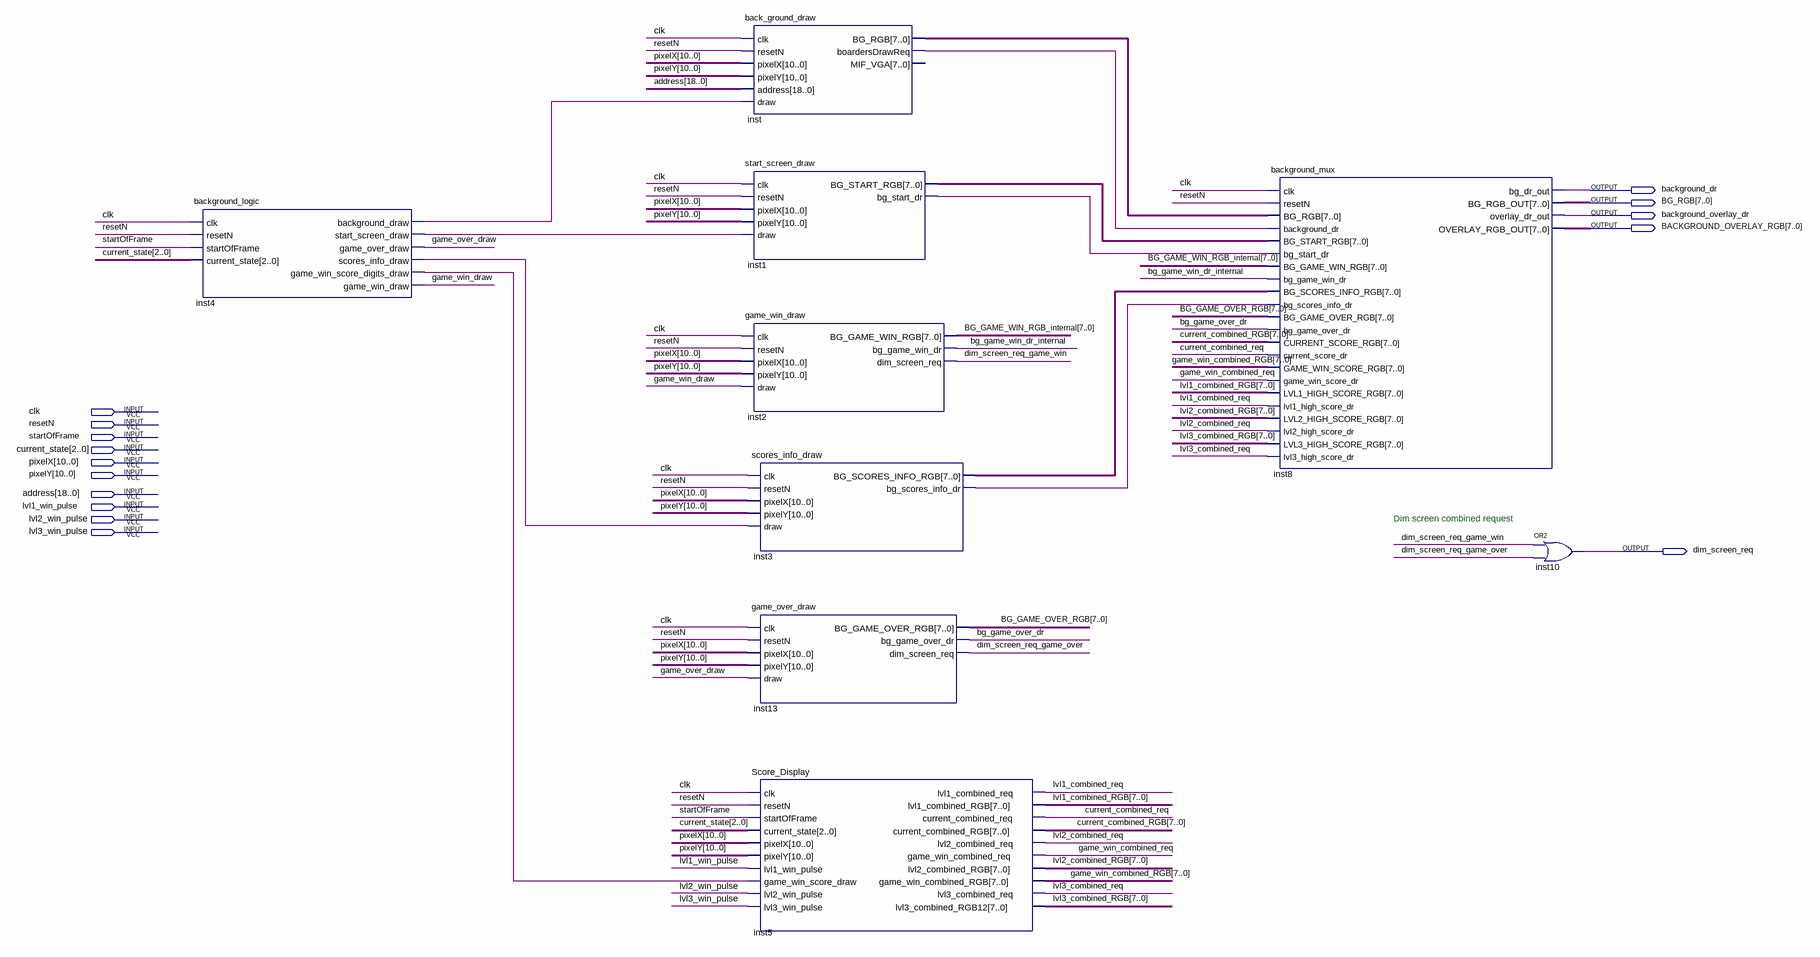
[diagram p0: schematic sheet]
// Quartus schematic background.bdf as structural Verilog: 9 symbols, 15 pins
module background (
  input  clk,
  input  resetN,
  input  startOfFrame,
  input  [2:0] current_state,
  input  [10:0] pixelX,
  input  [10:0] pixelY,
  input  [18:0] address,
  input  lvl1_win_pulse,
  input  lvl2_win_pulse,
  input  lvl3_win_pulse,
  output background_dr,
  output [7:0] BG_RGB,
  output background_overlay_dr,
  output [7:0] BACKGROUND_OVERLAY_RGB,
  output dim_screen_req
);

  wire bg_game_over_dr, bg_game_win_dr_internal, current_combined_req, dim_screen_req_game_over,
       dim_screen_req_game_win, game_over_draw, game_win_combined_req, game_win_draw, inst1_bg_start_dr,
       inst3_bg_scores_info_dr, inst4_background_draw, inst4_game_win_score_digits_draw,
       inst4_scores_info_draw, inst4_start_screen_draw, inst_boardersdrawreq, lvl1_combined_req,
       lvl2_combined_req, lvl3_combined_req;
  wire [7:0] BG_GAME_OVER_RGB, BG_GAME_WIN_RGB_internal, current_combined_RGB, game_win_combined_RGB,
       inst1_bg_start_rgb, inst3_bg_scores_info_rgb, inst_bg_rgb, lvl1_combined_RGB, lvl2_combined_RGB,
       lvl3_combined_RGB;

  background_logic inst4 (
    .clk(clk), .resetN(resetN), .startOfFrame(startOfFrame), .current_state(current_state),
    .background_draw(inst4_background_draw), .start_screen_draw(inst4_start_screen_draw),
    .game_over_draw(game_over_draw), .scores_info_draw(inst4_scores_info_draw),
    .game_win_score_digits_draw(inst4_game_win_score_digits_draw), .game_win_draw(game_win_draw));
  back_ground_draw inst (
    .clk(clk), .resetN(resetN), .pixelX(pixelX), .pixelY(pixelY), .address(address),
    .draw(inst4_background_draw), .BG_RGB(inst_bg_rgb), .boardersDrawReq(inst_boardersdrawreq));  // open: MIF_VGA
  start_screen_draw inst1 (
    .clk(clk), .resetN(resetN), .pixelX(pixelX), .pixelY(pixelY), .draw(inst4_start_screen_draw),
    .BG_START_RGB(inst1_bg_start_rgb), .bg_start_dr(inst1_bg_start_dr));
  game_win_draw inst2 (
    .clk(clk), .resetN(resetN), .pixelX(pixelX), .pixelY(pixelY), .draw(game_win_draw),
    .BG_GAME_WIN_RGB(BG_GAME_WIN_RGB_internal), .bg_game_win_dr(bg_game_win_dr_internal),
    .dim_screen_req(dim_screen_req_game_win));
  scores_info_draw inst3 (
    .clk(clk), .resetN(resetN), .pixelX(pixelX), .pixelY(pixelY), .draw(inst4_scores_info_draw),
    .BG_SCORES_INFO_RGB(inst3_bg_scores_info_rgb), .bg_scores_info_dr(inst3_bg_scores_info_dr));
  game_over_draw inst13 (
    .clk(clk), .resetN(resetN), .pixelX(pixelX), .pixelY(pixelY), .draw(game_over_draw),
    .BG_GAME_OVER_RGB(BG_GAME_OVER_RGB), .bg_game_over_dr(bg_game_over_dr),
    .dim_screen_req(dim_screen_req_game_over));
  Score_Display inst5 (
    .clk(clk), .resetN(resetN), .startOfFrame(startOfFrame), .current_state(current_state), .pixelX(pixelX),
    .pixelY(pixelY), .lvl1_win_pulse(lvl1_win_pulse), .game_win_score_draw(inst4_game_win_score_digits_draw),
    .lvl2_win_pulse(lvl2_win_pulse), .lvl3_win_pulse(lvl3_win_pulse), .lvl1_combined_req(lvl1_combined_req),
    .lvl1_combined_RGB(lvl1_combined_RGB), .current_combined_req(current_combined_req),
    .current_combined_RGB(current_combined_RGB), .lvl2_combined_req(lvl2_combined_req),
    .game_win_combined_req(game_win_combined_req), .lvl2_combined_RGB(lvl2_combined_RGB),
    .game_win_combined_RGB(game_win_combined_RGB), .lvl3_combined_req(lvl3_combined_req),
    .lvl3_combined_RGB12(lvl3_combined_RGB));
  background_mux inst8 (
    .clk(clk), .resetN(resetN), .BG_RGB(inst_bg_rgb), .background_dr(inst_boardersdrawreq),
    .BG_START_RGB(inst1_bg_start_rgb), .bg_start_dr(inst1_bg_start_dr),
    .BG_GAME_WIN_RGB(BG_GAME_WIN_RGB_internal), .bg_game_win_dr(bg_game_win_dr_internal),
    .BG_SCORES_INFO_RGB(inst3_bg_scores_info_rgb), .bg_scores_info_dr(inst3_bg_scores_info_dr),
    .BG_GAME_OVER_RGB(BG_GAME_OVER_RGB), .bg_game_over_dr(bg_game_over_dr),
    .CURRENT_SCORE_RGB(current_combined_RGB), .current_score_dr(current_combined_req),
    .GAME_WIN_SCORE_RGB(game_win_combined_RGB), .game_win_score_dr(game_win_combined_req),
    .LVL1_HIGH_SCORE_RGB(lvl1_combined_RGB), .lvl1_high_score_dr(lvl1_combined_req),
    .LVL2_HIGH_SCORE_RGB(lvl2_combined_RGB), .lvl2_high_score_dr(lvl2_combined_req),
    .LVL3_HIGH_SCORE_RGB(lvl3_combined_RGB), .lvl3_high_score_dr(lvl3_combined_req),
    .bg_dr_out(background_dr), .BG_RGB_OUT(BG_RGB), .overlay_dr_out(background_overlay_dr),
    .OVERLAY_RGB_OUT(BACKGROUND_OVERLAY_RGB));
  or inst10 (dim_screen_req, dim_screen_req_game_win, dim_screen_req_game_over);

  // Notes on the sheet:
  //   Dim screen combined request
endmodule
